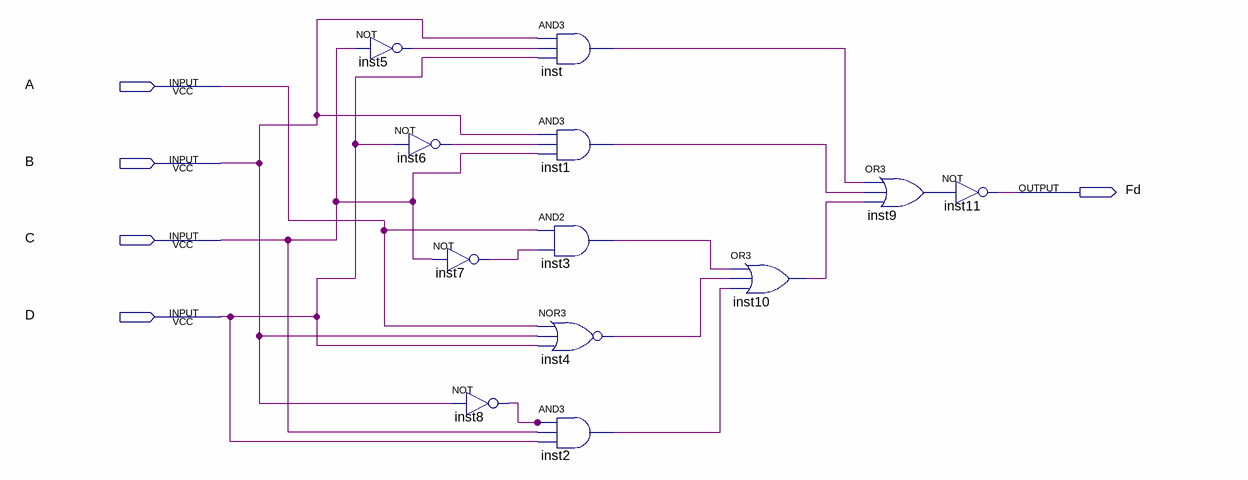
[diagram p0: schematic sheet]
// Quartus schematic fd.bdf as structural Verilog: 12 symbols, 5 pins
module fd (
  input  A,
  input  B,
  input  C,
  input  D,
  output Fd
);

  wire inst1_out, inst2_out, inst3_out, inst4_out, inst5_out, inst6_out, inst7_out, inst8_out, inst9_out,
       inst10_out, inst_out;

  not inst5 (inst5_out, C);
  not inst6 (inst6_out, D);
  not inst7 (inst7_out, C);
  not inst8 (inst8_out, B);
  and inst (inst_out, B, inst5_out, D);
  and inst1 (inst1_out, B, inst6_out, C);
  and inst3 (inst3_out, A, inst7_out);
  nor inst4 (inst4_out, A, B, D);
  and inst2 (inst2_out, inst8_out, C, D);
  or inst10 (inst10_out, inst3_out, inst4_out, inst2_out);
  or inst9 (inst9_out, inst_out, inst1_out, inst10_out);
  not inst11 (Fd, inst9_out);
endmodule
